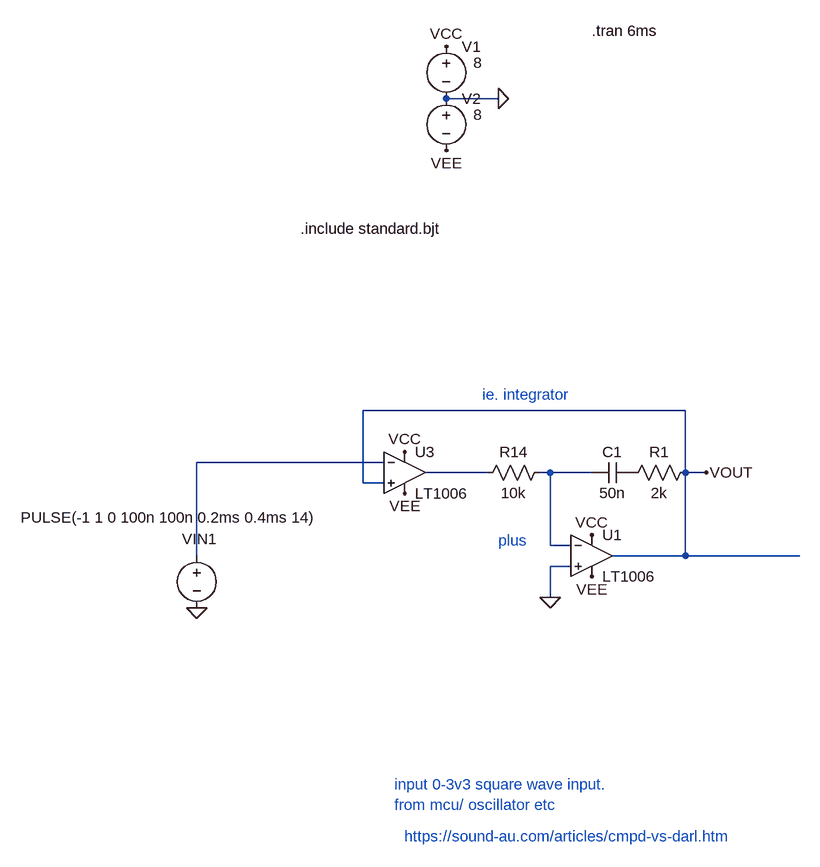
[diagram p0: schematic Draft100.asc]
Draft100.asc, the LTspice schematic file:
Version 4
SHEET 1 3300 1956
WIRE 544 -288 464 -288
WIRE 832 192 336 192
WIRE 368 272 80 272
WIRE 528 288 432 288
WIRE 624 288 608 288
WIRE 688 288 624 288
WIRE 832 288 832 192
WIRE 864 288 832 288
WIRE 336 304 336 192
WIRE 368 304 336 304
WIRE 624 400 624 288
WIRE 656 400 624 400
WIRE 80 416 80 272
WIRE 832 416 832 288
WIRE 832 416 720 416
WIRE 1008 416 832 416
WIRE 656 432 624 432
WIRE 624 480 624 432
FLAG 464 -368 VCC
FLAG 80 496 0
FLAG 544 -288 0
FLAG 624 480 0
FLAG 688 384 VCC
FLAG 400 256 VCC
FLAG 864 288 VOUT
FLAG 464 -208 VEE
FLAG 688 448 VEE
FLAG 400 320 VEE
SYMBOL voltage 464 -384 R0
WINDOW 123 0 0 Left 0
WINDOW 39 0 0 Left 0
WINDOW 3 42 41 Left 2
SYMATTR Value 8
SYMATTR InstName V1
SYMBOL voltage 80 400 R0
WINDOW 123 0 0 Left 0
WINDOW 39 0 0 Left 0
WINDOW 3 -271 -43 Left 2
WINDOW 0 -23 -10 Left 2
SYMATTR Value PULSE(-1 1 0 100n 100n 0.2ms 0.4ms 14)
SYMATTR InstName VIN1
SYMBOL res 512 304 R270
WINDOW 0 32 56 VTop 2
WINDOW 3 0 56 VBottom 2
SYMATTR InstName R14
SYMATTR Value 10k
SYMBOL cap 752 272 R90
WINDOW 0 0 32 VBottom 2
WINDOW 3 32 32 VTop 2
SYMATTR InstName C1
SYMATTR Value 50n
SYMBOL OpAmps\\LT1006 688 352 R0
SYMATTR InstName U1
SYMBOL OpAmps\\LT1006 400 224 R0
SYMATTR InstName U3
SYMBOL voltage 464 -304 R0
WINDOW 123 0 0 Left 0
WINDOW 39 0 0 Left 0
WINDOW 3 42 41 Left 2
SYMATTR Value 8
SYMATTR InstName V2
SYMBOL res 736 304 R270
WINDOW 0 32 56 VTop 2
WINDOW 3 0 56 VBottom 2
SYMATTR InstName R1
SYMATTR Value 2k
TEXT 688 -392 Left 2 !.tran 6ms
TEXT 544 392 Left 2 ;plus
TEXT 384 768 Left 2 ;input 0-3v3 square wave input.\nfrom mcu/ oscillator etc
TEXT 240 -88 Left 2 !.include standard.bjt
TEXT 520 168 Left 2 ;ie. integrator
TEXT 400 848 Left 2 ;https://sound-au.com/articles/cmpd-vs-darl.htm

The netlist it stands for:
* Draft100.asc
V1 VCC 0 8
VIN1 N001 0 PULSE(-1 1 0 100n 100n 0.2ms 0.4ms 14)
R14 N002 N003 10k
C1 P001 N003 50n
XU1 0 N003 VCC VEE VOUT LT1006  ; pins In+ In- V+ V- OUT
XU3 VOUT N001 VCC VEE N002 LT1006  ; pins In+ In- V+ V- OUT
V2 0 VEE 8
R1 P001 VOUT 2k
.tran 6ms
* plus
* input 0-3v3 square wave input.
* from mcu/ oscillator etc
.include standard.bjt
* ie. integrator
* https://sound-au.com/articles/cmpd-vs-darl.htm
.lib LTC.lib
.backanno
.end